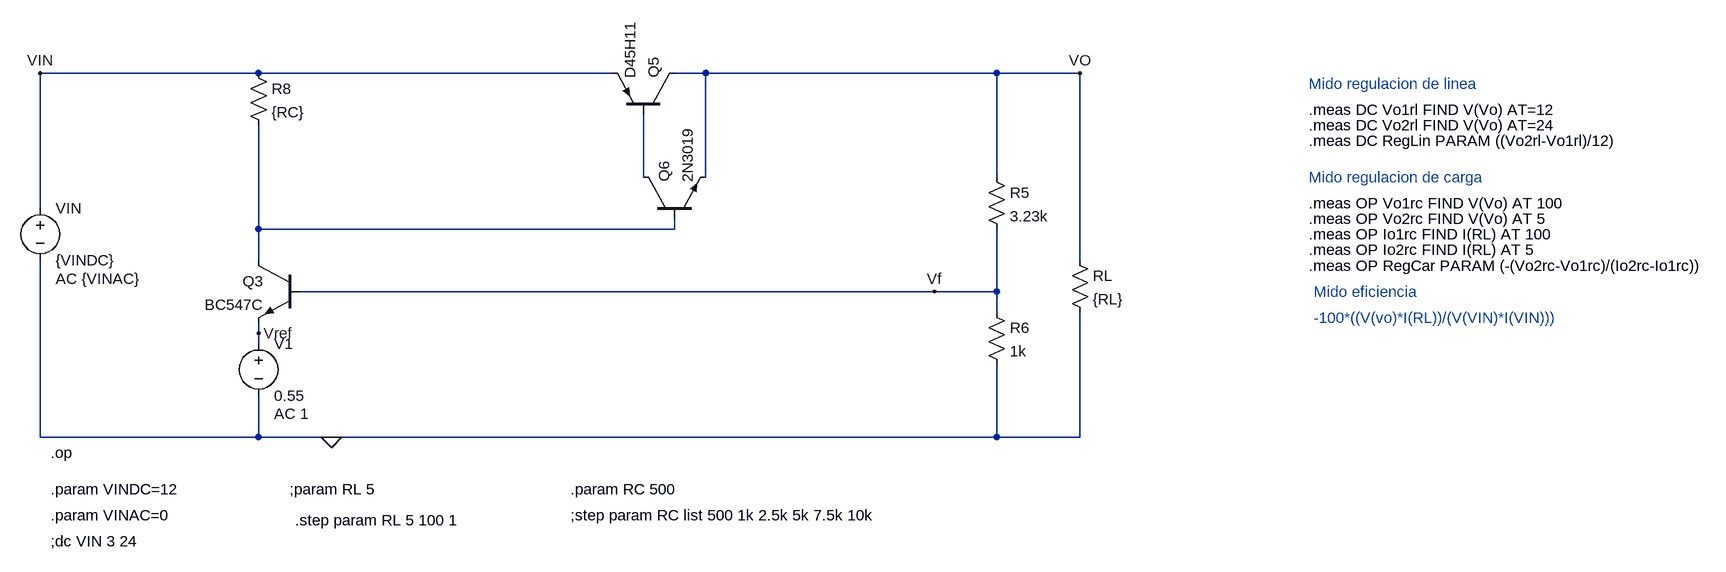
[diagram p0: schematic Regulador_lineal_version3.asc]
Regulador_lineal_version3.asc, the LTspice schematic file:
Version 4
SHEET 1 2372 808
WIRE 96 -32 -240 -32
WIRE 640 -32 96 -32
WIRE 784 -32 736 -32
WIRE 1232 -32 784 -32
WIRE 1360 -32 1232 -32
WIRE 688 128 688 32
WIRE 784 128 784 -32
WIRE 1232 128 1232 -32
WIRE -240 176 -240 -32
WIRE 96 208 96 48
WIRE 736 208 736 192
WIRE 736 208 96 208
WIRE 96 256 96 208
WIRE 1360 256 1360 -32
WIRE 1136 304 160 304
WIRE 1232 304 1232 208
WIRE 1232 304 1136 304
WIRE 1232 336 1232 304
WIRE 96 368 96 352
WIRE 96 384 96 368
WIRE -240 528 -240 256
WIRE 96 528 96 464
WIRE 96 528 -240 528
WIRE 208 528 96 528
WIRE 1232 528 1232 416
WIRE 1232 528 208 528
WIRE 1360 528 1360 336
WIRE 1360 528 1232 528
FLAG 208 528 0
FLAG 1360 -32 VO
FLAG 96 368 Vref
FLAG -240 -32 VIN
FLAG 1136 304 Vf
DATAFLAG 1200 -32 ""
DATAFLAG 624 304 ""
DATAFLAG 544 208 ""
SYMBOL npn 160 256 M0
SYMATTR InstName Q3
SYMATTR Value BC547C
SYMBOL pnp 736 32 M270
SYMATTR InstName Q5
SYMATTR Value D45H11
SYMBOL npn 688 192 R270
SYMATTR InstName Q6
SYMATTR Value 2N3019
SYMBOL res 1216 112 R0
SYMATTR InstName R5
SYMATTR Value 3.23k
SYMBOL res 1216 320 R0
SYMATTR InstName R6
SYMATTR Value 1k
SYMBOL res 1344 240 R0
SYMATTR InstName RL
SYMATTR Value {RL}
SYMBOL voltage 96 368 R0
WINDOW 123 24 124 Left 2
WINDOW 39 24 152 Left 2
SYMATTR Value2 AC 1
SYMATTR InstName V1
SYMATTR Value 0.55
SYMBOL voltage -240 160 R0
WINDOW 123 24 124 Left 2
WINDOW 39 0 0 Left 0
SYMATTR Value2 AC {VINAC}
SYMATTR InstName VIN
SYMATTR Value {VINDC}
SYMBOL res 80 -48 R0
SYMATTR InstName R8
SYMATTR Value {RC}
TEXT -224 552 Left 2 !.op
TEXT -224 688 Left 2 !;dc VIN 3 24
TEXT 152 656 Left 2 !.step param RL 5 100 1
TEXT 144 608 Left 2 !;param RL 5
TEXT 1712 -16 Left 2 ;Mido regulacion de linea
TEXT 1712 24 Left 2 !.meas DC Vo1rl FIND V(Vo) AT=12
TEXT 1712 48 Left 2 !.meas DC Vo2rl FIND V(Vo) AT=24
TEXT 1712 72 Left 2 !.meas DC RegLin PARAM ((Vo2rl-Vo1rl)/12)
TEXT 1712 128 Left 2 ;Mido regulacion de carga
TEXT 1712 168 Left 2 !.meas OP Vo1rc FIND V(Vo) AT 100
TEXT 1712 192 Left 2 !.meas OP Vo2rc FIND V(Vo) AT 5
TEXT 1712 264 Left 2 !.meas OP RegCar PARAM (-(Vo2rc-Vo1rc)/(Io2rc-Io1rc))
TEXT 1712 216 Left 2 !.meas OP Io1rc FIND I(RL) AT 100
TEXT 1712 240 Left 2 !.meas OP Io2rc FIND I(RL) AT 5
TEXT 1720 304 Left 2 ;Mido eficiencia
TEXT 1720 344 Left 2 ;-100*((V(vo)*I(RL))/(V(VIN)*I(VIN)))
TEXT 576 648 Left 2 !;step param RC list 500 1k 2.5k 5k 7.5k 10k
TEXT -224 608 Left 2 !.param VINDC=12
TEXT -224 648 Left 2 !.param VINAC=0
TEXT 576 608 Left 2 !.param RC 500

The netlist it stands for:
* Regulador_lineal_version3.asc
Q3 N002 Vf Vref 0 BC547C
Q5 VO N001 VIN 0 D45H11
Q6 N001 N002 VO 0 2N3019
R5 VO Vf 3.23k
R6 Vf 0 1k
RL VO 0 {RL}
V1 Vref 0 0.55 AC 1
VIN VIN 0 {VINDC} AC {VINAC}
R8 VIN N002 {RC}
.model NPN NPN
.model PNP PNP
.lib standard.bjt
.op
;dc VIN 3 24
.step param RL 5 100 1
;param RL 5
* Mido regulacion de linea
.meas DC Vo1rl FIND V(Vo) AT=12
.meas DC Vo2rl FIND V(Vo) AT=24
.meas DC RegLin PARAM ((Vo2rl-Vo1rl)/12)
* Mido regulacion de carga
.meas OP Vo1rc FIND V(Vo) AT 100
.meas OP Vo2rc FIND V(Vo) AT 5
.meas OP RegCar PARAM (-(Vo2rc-Vo1rc)/(Io2rc-Io1rc))
.meas OP Io1rc FIND I(RL) AT 100
.meas OP Io2rc FIND I(RL) AT 5
* Mido eficiencia
* -100*((V(vo)*I(RL))/(V(VIN)*I(VIN)))
;step param RC list 500 1k 2.5k 5k 7.5k 10k
.param VINDC=12
.param VINAC=0
.param RC 500
.backanno
.end